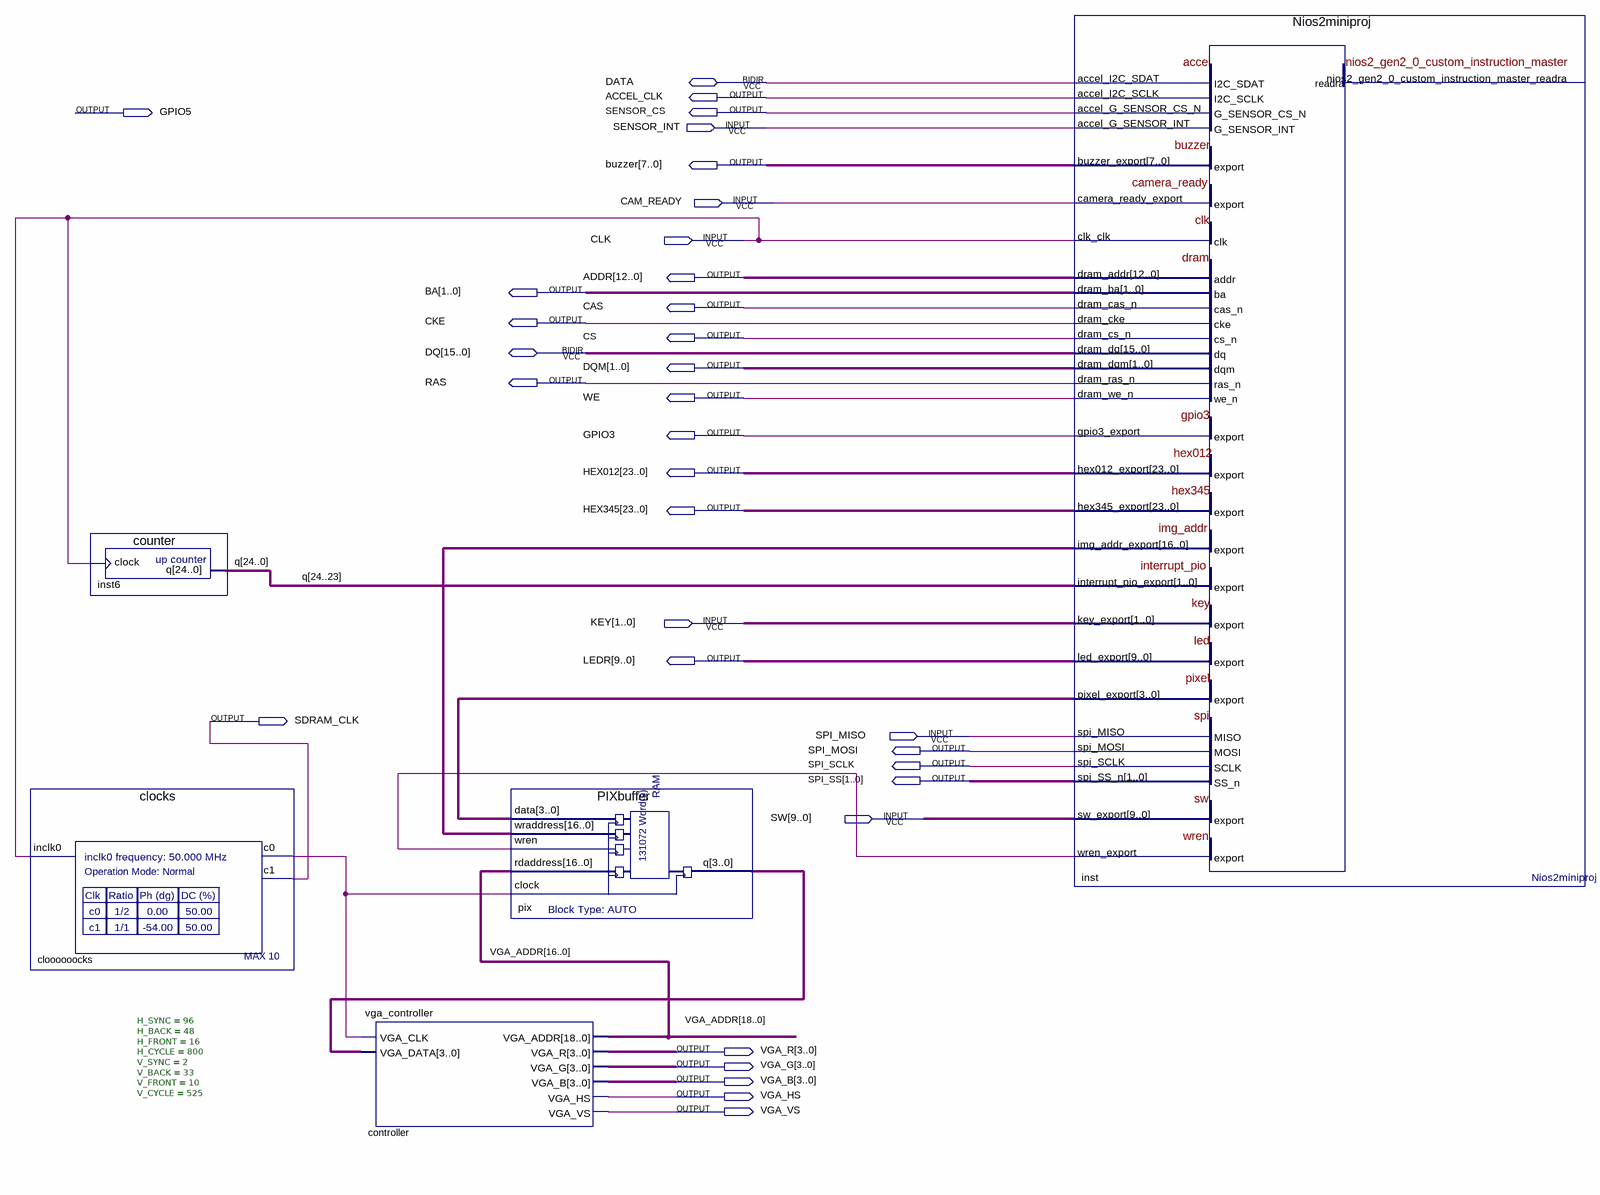
[diagram p0: schematic sheet]
// Quartus schematic MiniProject.bdf as structural Verilog: 5 symbols, 33 pins
module MiniProject (
  input  SENSOR_INT,
  input  CAM_READY,
  input  CLK,
  input  [1:0] KEY,
  input  SPI_MISO,
  input  [9:0] SW,
  inout  DATA,
  inout  [15:0] DQ,
  output ACCEL_CLK,
  output GPIO5,
  output SENSOR_CS,
  output [7:0] buzzer,
  output [12:0] ADDR,
  output [1:0] BA,
  output CAS,
  output CKE,
  output CS,
  output [1:0] DQM,
  output RAS,
  output WE,
  output GPIO3,
  output [23:0] HEX012,
  output [23:0] HEX345,
  output [9:0] LEDR,
  output SDRAM_CLK,
  output SPI_MOSI,
  output SPI_SCLK,
  output [1:0] SPI_SS,
  output [3:0] VGA_R,
  output [3:0] VGA_G,
  output [3:0] VGA_B,
  output VGA_HS,
  output VGA_VS
);

  wire cloooooocks_c0, inst_wren_export;
  wire [3:0] inst_pixel_export, pix_q;
  wire [16:0] inst_img_addr_export;
  wire [18:0] VGA_ADDR;
  wire [24:0] q;

  clocks cloooooocks (.inclk0(CLK), .c0(cloooooocks_c0), .c1(SDRAM_CLK));
  counter inst6 (.clock(CLK), .q(q));
  vga_controller #(.H_SYNC(96), .H_BACK(48), .H_FRONT(16), .H_CYCLE(800), .V_SYNC(2), .V_BACK(33), .V_FRONT(10), .V_CYCLE(525)) controller (
    .VGA_CLK(cloooooocks_c0), .VGA_DATA(pix_q), .VGA_ADDR(VGA_ADDR), .VGA_R(VGA_R), .VGA_G(VGA_G),
    .VGA_B(VGA_B), .VGA_HS(VGA_HS), .VGA_VS(VGA_VS));
  PIXbuffer pix (
    .data(inst_pixel_export), .wraddress(inst_img_addr_export), .wren(inst_wren_export),
    .rdaddress(VGA_ADDR[16:0]), .clock(cloooooocks_c0), .q(pix_q));
  Nios2miniproj inst (
    .accel_G_SENSOR_INT(SENSOR_INT), .camera_ready_export(CAM_READY), .clk_clk(CLK),
    .interrupt_pio_export(q[24:23]), .key_export(KEY), .spi_MISO(SPI_MISO), .sw_export(SW),
    .accel_I2C_SCLK(ACCEL_CLK), .accel_G_SENSOR_CS_N(SENSOR_CS), .buzzer_export(buzzer), .dram_addr(ADDR),
    .dram_ba(BA), .dram_cas_n(CAS), .dram_cke(CKE), .dram_cs_n(CS), .dram_dqm(DQM), .dram_ras_n(RAS),
    .dram_we_n(WE), .gpio3_export(GPIO3), .hex012_export(HEX012), .hex345_export(HEX345),
    .img_addr_export(inst_img_addr_export), .led_export(LEDR), .pixel_export(inst_pixel_export),
    .spi_MOSI(SPI_MOSI), .spi_SCLK(SPI_SCLK), .spi_SS_n(SPI_SS), .wren_export(inst_wren_export),
    .accel_I2C_SDAT(DATA), .dram_dq(DQ));  // open: nios2_gen2_0_custom_instruction_master_readra
endmodule
